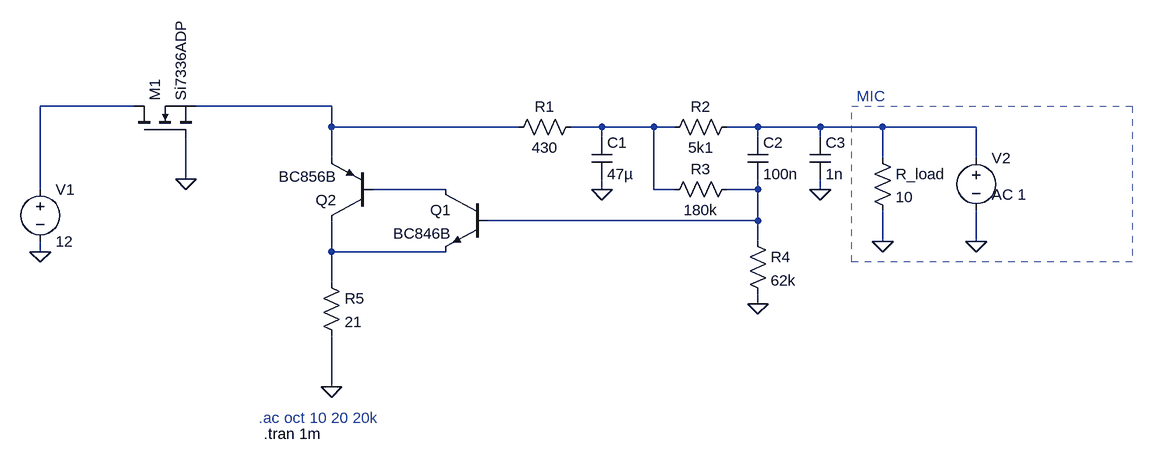
[diagram p0: schematic microphone_circuit.asc]
microphone_circuit.asc, the LTspice schematic file:
Version 4
SHEET 1 1544 696
WIRE -304 -32 -448 -32
WIRE 0 -32 -208 -32
WIRE 0 0 0 -32
WIRE 288 0 0 0
WIRE 416 0 368 0
WIRE 496 0 416 0
WIRE 528 0 496 0
WIRE 656 0 608 0
WIRE 752 0 656 0
WIRE 848 0 752 0
WIRE 992 0 848 0
WIRE 416 16 416 0
WIRE 656 16 656 0
WIRE 752 16 752 0
WIRE 0 48 0 0
WIRE 848 48 848 0
WIRE 992 48 992 0
WIRE -224 80 -224 16
WIRE -448 96 -448 -32
WIRE 176 96 64 96
WIRE 416 96 416 80
WIRE 496 96 496 0
WIRE 528 96 496 96
WIRE 656 96 656 80
WIRE 656 96 608 96
WIRE 752 96 752 80
WIRE 656 144 656 96
WIRE 656 144 240 144
WIRE 656 176 656 144
WIRE 848 176 848 128
WIRE 992 176 992 128
WIRE -448 192 -448 176
WIRE 0 192 0 144
WIRE 176 192 0 192
WIRE 0 240 0 192
WIRE 656 272 656 256
WIRE 0 400 0 320
FLAG 0 400 0
FLAG 416 96 0
FLAG 992 176 0
FLAG 656 272 0
FLAG -448 192 0
FLAG 848 176 0
FLAG 752 96 0
FLAG -224 80 0
SYMBOL npn 240 96 M0
SYMATTR InstName Q1
SYMATTR Value BC846B
SYMBOL pnp 64 144 R180
SYMATTR InstName Q2
SYMATTR Value BC856B
SYMBOL res 272 16 R270
WINDOW 0 32 56 VTop 2
WINDOW 3 0 56 VBottom 2
SYMATTR InstName R1
SYMATTR Value 430
SYMBOL res 512 16 R270
WINDOW 0 32 56 VTop 2
WINDOW 3 0 56 VBottom 2
SYMATTR InstName R2
SYMATTR Value 5k1
SYMBOL cap 400 16 R0
SYMATTR InstName C1
SYMATTR Value 47µ
SYMATTR SpiceLine V=25
SYMBOL res 512 112 R270
WINDOW 0 32 56 VTop 2
WINDOW 3 0 56 VBottom 2
SYMATTR InstName R3
SYMATTR Value 180k
SYMBOL res 832 32 R0
SYMATTR InstName R_load
SYMATTR Value 10
SYMBOL cap 640 16 R0
SYMATTR InstName C2
SYMATTR Value 100n
SYMBOL res 640 160 R0
SYMATTR InstName R4
SYMATTR Value 62k
SYMBOL voltage -448 80 R0
WINDOW 123 0 0 Left 0
WINDOW 39 0 0 Left 0
SYMATTR InstName V1
SYMATTR Value 12
SYMBOL voltage 992 32 R0
WINDOW 123 24 72 Left 2
WINDOW 39 0 0 Left 0
WINDOW 3 24 44 Left 2
SYMATTR Value2 AC 1
SYMATTR Value ""
SYMATTR InstName V2
SYMBOL res -16 224 R0
SYMATTR InstName R5
SYMATTR Value 21
SYMBOL cap 736 16 R0
SYMATTR InstName C3
SYMATTR Value 1n
SYMBOL nmos -304 16 R270
SYMATTR InstName M1
SYMATTR Value Si7336ADP
TEXT 808 -48 Left 2 ;MIC
TEXT -104 472 Left 2 !.tran 1m
TEXT -112 448 Left 2 ;.ac oct 10 20 20k
RECTANGLE Normal 1232 208 800 -32 2

The netlist it stands for:
* microphone_circuit.asc
Q1 N005 N006 N007 0 BC846B
Q2 N007 N005 N002 0 BC856B
R1 N002 N003 430
R2 N003 N004 5k1
C1 N003 0 47µ V=25
R3 N003 N006 180k
R_load N004 0 10
C2 N004 N006 100n
R4 N006 0 62k
V1 N001 0 12
V2 N004 0 AC 1
R5 N007 0 21
C3 N004 0 1n
M1 N001 0 N002 N002 Si7336ADP
.model NPN NPN
.model PNP PNP
.lib standard.bjt
.model NMOS NMOS
.model PMOS PMOS
.lib standard.mos
* MIC
.tran 1m
* .ac oct 10 20 20k
.backanno
.end